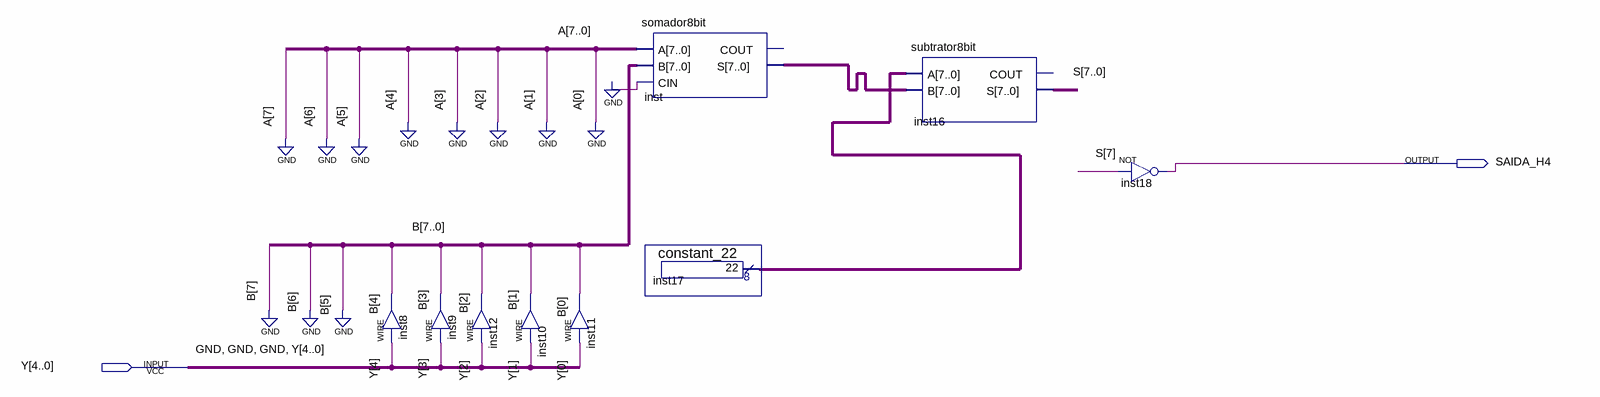
[diagram p0: schematic sheet]
// Quartus schematic quadrado_h4.bdf as structural Verilog: 9 symbols, 2 pins
module quadrado_h4 (
  input  [4:0] Y,
  output SAIDA_H4
);

  wire [4:0] B;
  wire [7:0] inst17_result, inst_s, S;

  assign B[4] = Y[4];  // WIRE inst8
  assign B[3] = Y[3];  // WIRE inst9
  assign B[1] = Y[1];  // WIRE inst10
  assign B[2] = Y[2];  // WIRE inst12
  assign B[0] = Y[0];  // WIRE inst11
  somador8bit inst (.A({8{1'b0}}), .B({3'b000, B}), .CIN(1'b0), .S(inst_s));  // open: COUT
  constant_22 inst17 (.result(inst17_result));
  subtrator8bit inst16 (.A(inst17_result), .B(inst_s), .S(S));  // open: COUT
  not inst18 (SAIDA_H4, S[7]);
endmodule
